# Altium schematic sheet vswr.SchDoc: VSWR Meter
size Letter; CheckedBy: J. Brinton; CompanyName: Signal Laboratories, Inc.; DrawnBy: J. Brinton; Engineer: J. Brinton; Address1: 3479 Edison Way; Address2: Menlo Park CA 94025; Address3: +1 (877) 778-8435; Address4: siglabs.com; Revision: 3; SheetNumber: 17; SheetTotal: 49
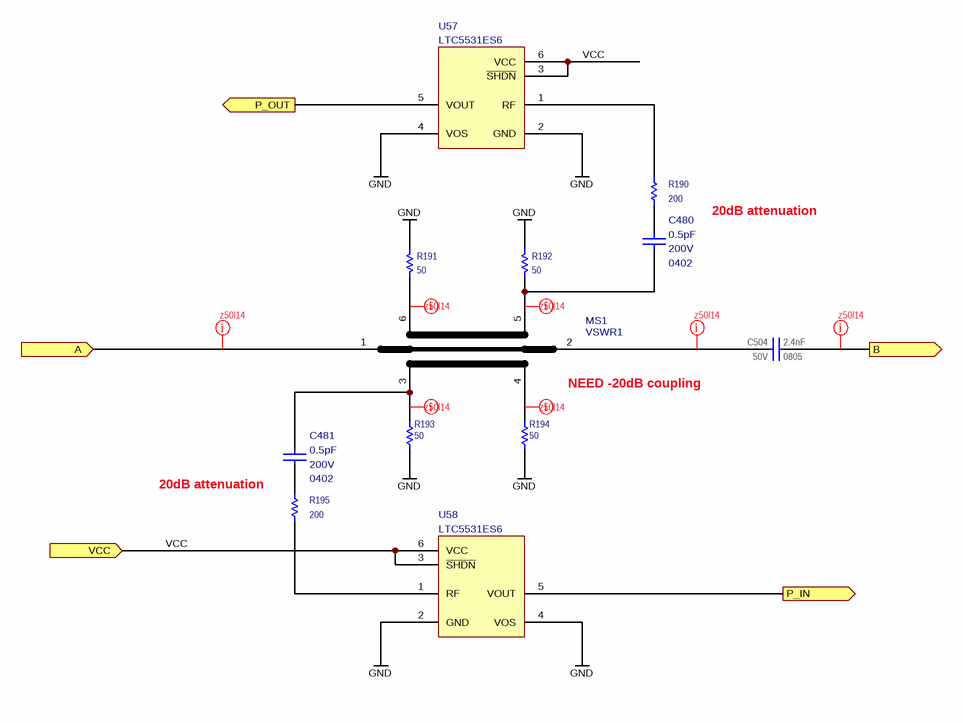
[diagram p0: vswr.SchDoc]

## Parts
C480  value 0.5pF  Package: 0402  Voltage: 200V  [CAPC100X50X55L25N]  (hidden comment: 600L0R5AT200T)
C481  value 0.5pF  Package: 0402  Voltage: 200V  [CAPC100X50X55L25N]  (hidden comment: 600L0R5AT200T)
C504  value 2.4nF  Voltage: 50V  Package: 0805  [CAPC2012X145N]  (hidden comment: C08BL242X-5UN-X0T)
MS1  VSWR1  [VSWR1]  (net tie, no BOM)
R190  value 200  [RESC1005X40N]  (hidden comment: FC0402E2000BTT0)
R191  value 50  [RESC1005X40N]  (hidden comment: FC0402E50R0BST1)
R192  value 50  [RESC1005X40N]  (hidden comment: FC0402E50R0BST1)
R193  value 50  [RESC1005X40N]  (hidden comment: FC0402E50R0BST1)
R194  value 50  [RESC1005X40N]  (hidden comment: FC0402E50R0BST1)
R195  value 200  [RESC1005X40N]  (hidden comment: FC0402E2000BTT0)
U57  LTC5531ES6  [SOT23-6]
U58  LTC5531ES6  [SOT23-6]

## Ports
A (in), B (out), P_IN (out), P_OUT (out), VCC (in)

## Nets
GND: R191.1 R192.1 R193.1 R194.1 U57.2(GND) U57.4(VOS) U58.2(GND) U58.4(VOS)
A: MS1.1(S1) ; port A
B: C504.1 ; port B
P_IN: U58.5(VOUT) ; port P_IN
P_OUT: U57.5(VOUT) ; port P_OUT
VCC: U57.3(~{SHDN}) U57.6(VCC) U58.3(~{SHDN}) U58.6(VCC) ; port VCC
NetC480_1: C480.1 R190.1
NetC480_2: C480.2 MS1.5(S5) R192.2
NetC481_1: C481.1 MS1.3(S3) R193.2
NetC481_2: C481.2 R195.2
NetC504_2: C504.2 MS1.2(S2)
NetMS1_4: MS1.4(S4) R194.2
NetMS1_6: MS1.6(S6) R191.2
NetR190_2: R190.2 U57.1(RF)
NetR195_1: R195.1 U58.1(RF)

## Layout directives
net class z50l14: A, B, NetC480_2, NetC481_1, NetC504_2, NetMS1_4, NetMS1_6

## Notes on the sheet
- 20dB attenuation
- (near MS1) NEED -20dB coupling
- Title
- Engineer
- Revision
- Drawn By
- Checked By
- Date
- Sheet
- of

## Library data of the parts
C480 C481 = VJ0402A1R0BXX: Ceramic Capacitor 0.5pF ±0.05pF 200V C0G 0402; Manufacturer: American Technical Ceramics; Tr: -55:125; Manufacturer P/N: 600L0R5AT200T; Tolerance: ±0.05pF
C504 = CAP: Ceramic Capacitor 2.4nF 50V 0805; Manufacturer: Dielectric Laboratories; Tr: -55:105; Manufacturer P/N: C08BL242X-5UN-X0T
MS1 = VSWR1: VSWR Meter Stripline
R190 R195 = RES 0603: Thin Film RF Resistor 200 Ohm ±0.1% 0402; Manufacturer: Vishay; Tr: -55:155; Package: 0402; Manufacturer P/N: FC0402E2000BTT0; Do Not Place: *; Tolerance: ±0.1%
R191-R194 = RES 0603: Thin Film RF Resistor 50 Ohm ±0.1% 0402; Manufacturer: Vishay; Tr: -55:155; Package: 0402; Manufacturer P/N: FC0402E50R0BST1; Do Not Place: *; Tolerance: ±0.1%
U57 U58 = LTC5531ES6: RF Detector; Manufacturer: Linear Technology; Manufacturer P/N: LTC5531ES6